# Altium project OBC_FyCUS23.PrjPcb
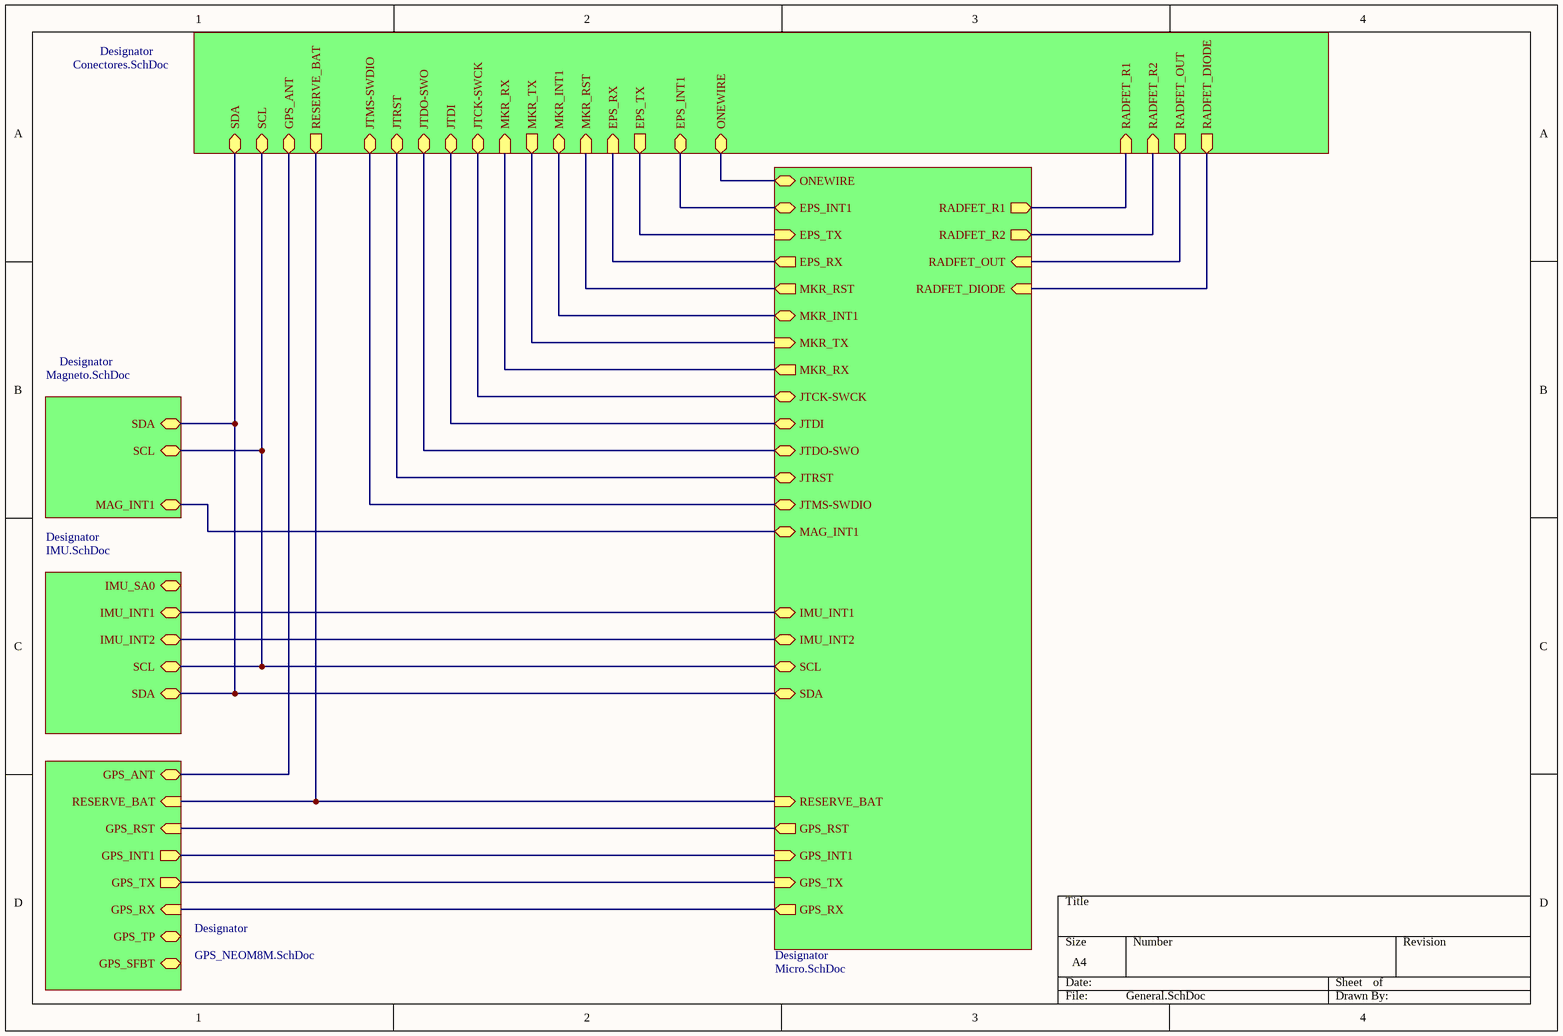
[diagram p0: General.SchDoc]
6 sheets, 50 parts. Net scope: hierarchical (ports join the sheet entries above them; power ports are global).
Board file: OBC_PCB.PcbDoc
Sheets:
  General.SchDoc
    Designator = GPS_NEOM8M.SchDoc
    Designator = Magneto.SchDoc
    Designator = Micro.SchDoc
    Designator = IMU.SchDoc
    Designator = Conectores.SchDoc

## Sheet General.SchDoc
size A4; SheetNumber: 1; SheetTotal: 6

### Sub-sheets
Designator = GPS_NEOM8M.SchDoc: GPS_RST (in), GPS_INT1 (out), GPS_TX (out), GPS_RX (in), RESERVE_BAT (in), GPS_TP (bidir), GPS_SFBT (bidir), GPS_ANT (bidir)
Designator = Magneto.SchDoc: SCL (bidir), SDA (bidir), MAG_INT1 (bidir)
Designator = Micro.SchDoc: GPS_RX (out), GPS_TX (in), GPS_INT1 (in), GPS_RST (out), IMU_INT1 (bidir), SCL (bidir), SDA (bidir), IMU_INT2 (bidir), MAG_INT1 (bidir), MKR_RX (out), MKR_TX (in), JTCK-SWCK (bidir), JTDI (bidir), JTDO-SWO (bidir), JTRST (bidir), JTMS-SWDIO (bidir), MKR_INT1 (bidir), MKR_RST (out), RESERVE_BAT (in), EPS_TX (in), EPS_RX (out), ONEWIRE (bidir), EPS_INT1 (bidir), RADFET_R1 (out), RADFET_R2 (out), RADFET_OUT (in), RADFET_DIODE (in)
Designator = IMU.SchDoc: IMU_SA0 (bidir), IMU_INT1 (bidir), SCL (bidir), SDA (bidir), IMU_INT2 (bidir)
Designator = Conectores.SchDoc: MKR_RX (in), MKR_TX (out), JTCK-SWCK (bidir), JTDI (bidir), JTDO-SWO (bidir), JTRST (bidir), JTMS-SWDIO (bidir), SCL (bidir), SDA (bidir), MKR_INT1 (bidir), MKR_RST (in), RESERVE_BAT (out), GPS_ANT (bidir), EPS_TX (out), EPS_RX (in), ONEWIRE (bidir), EPS_INT1 (bidir), RADFET_R1 (in), RADFET_R2 (in), RADFET_OUT (out), RADFET_DIODE (out)

### Nets
ANTENNA: sheet Designator/GPS_ANT, sheet Designator/GPS_ANT
JTCK-SWCK: sheet Designator/JTCK-SWCK, sheet Designator/JTCK-SWCK
JTDI: sheet Designator/JTDI, sheet Designator/JTDI
JTDO-SWO: sheet Designator/JTDO-SWO, sheet Designator/JTDO-SWO
JTMS-SWDIO: sheet Designator/JTMS-SWDIO, sheet Designator/JTMS-SWDIO
JTRST: sheet Designator/JTRST, sheet Designator/JTRST
LPUART1_RX: sheet Designator/MKR_TX, sheet Designator/MKR_TX
LPUART1_TX: sheet Designator/MKR_RX, sheet Designator/MKR_RX
ONEWIRE_PIN: sheet Designator/ONEWIRE, sheet Designator/ONEWIRE
SCL: sheet Designator/SCL, sheet Designator/SCL, sheet Designator/SCL, sheet Designator/SCL
SDA: sheet Designator/SDA, sheet Designator/SDA, sheet Designator/SDA, sheet Designator/SDA
USART2_RX: sheet Designator/EPS_TX, sheet Designator/EPS_TX
USART2_TX: sheet Designator/EPS_RX, sheet Designator/EPS_RX
USART3_RX: sheet Designator/GPS_TX, sheet Designator/GPS_TX
USART3_TX: sheet Designator/GPS_RX, sheet Designator/GPS_RX
VBAT: sheet Designator/RESERVE_BAT, sheet Designator/RESERVE_BAT, sheet Designator/RESERVE_BAT
NetC15_1: sheet Designator/MKR_RST, sheet Designator/MKR_RST
NetGPS_4: sheet Designator/GPS_INT1, sheet Designator/GPS_INT1
NetGPS_8: sheet Designator/GPS_RST, sheet Designator/GPS_RST
NetIMU_4: sheet Designator/IMU_INT1, sheet Designator/IMU_INT1
NetIMU_9: sheet Designator/IMU_INT2, sheet Designator/IMU_INT2
NetJ2_11: sheet Designator/RADFET_R1, sheet Designator/RADFET_R1
NetJ2_13: sheet Designator/RADFET_R2, sheet Designator/RADFET_R2
NetJ2_15: sheet Designator/RADFET_OUT, sheet Designator/RADFET_OUT
NetJ2_16: sheet Designator/RADFET_DIODE, sheet Designator/RADFET_DIODE
NetJ2_24: sheet Designator/EPS_INT1, sheet Designator/EPS_INT1
NetJ4_5: sheet Designator/MKR_INT1, sheet Designator/MKR_INT1
NetMAG_7: sheet Designator/MAG_INT1, sheet Designator/MAG_INT1

## Sheet GPS_NEOM8M.SchDoc
size A4; SheetNumber: 3; SheetTotal: 6
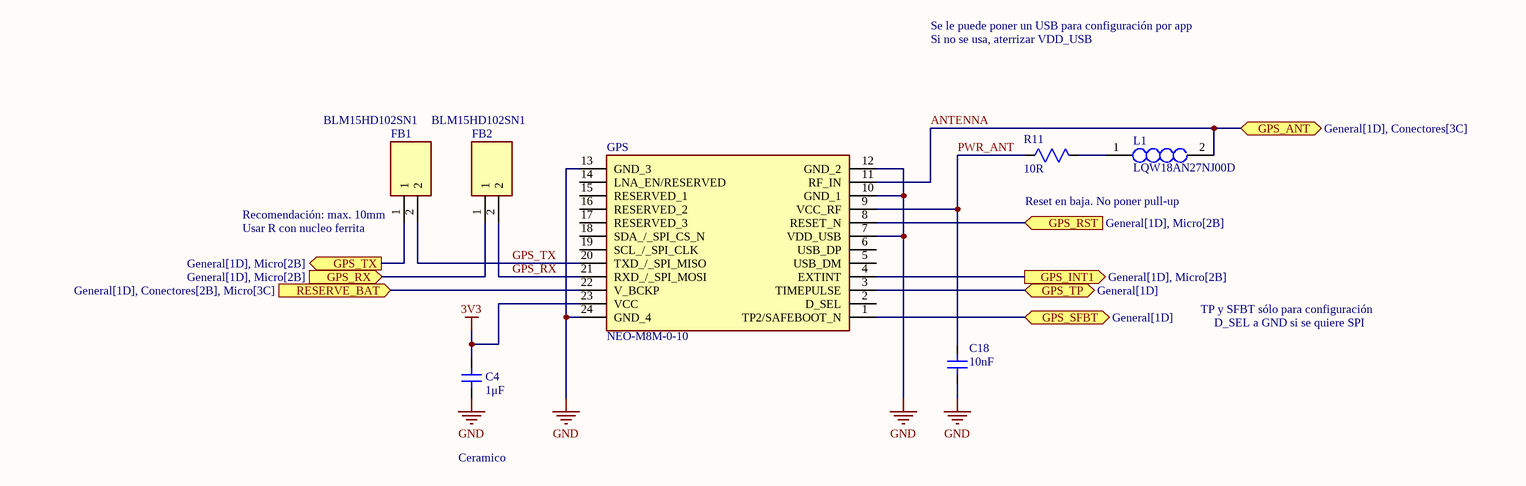
[diagram p1: GPS_NEOM8M.SchDoc]

### Parts
C4  Valor: 1μF  [CAP SMD 0805]  (hidden comment: CAP_0805_1uF)
C18  Valor: 10nF  [CAP SMD 0805]  (hidden comment: CAP_0805_1uF)
FB1  BLM15HD102SN1  [NFZ15SG152SN10B]
FB2  BLM15HD102SN1  [NFZ15SG152SN10B]
GPS  NEO-M8M-0-10  [NEO-M8T]
L1  LQW18AN27NJ00D  [LQW18AS10NG0CD]
R11  Valor: 10R  [RES SMD 0805]  (hidden comment: RES_0805_10k)

### Ports
GPS_ANT (bidir, see General[1D], Conectores[3C]), GPS_INT1 (out, see General[1D], Micro[2B]), GPS_RST (in, see General[1D], Micro[2B]), GPS_RX (in, see General[1D], Micro[2B]), GPS_SFBT (bidir, see General[1D]), GPS_TP (bidir, see General[1D]), GPS_TX (out, see General[1D], Micro[2B]), RESERVE_BAT (in, see General[1D], Conectores[2B], Micro[3C])

### Nets
3V3: C4.1 GPS.23(VCC)  [project net VDD]
GND: C4.2 C18.1 GPS.7(VDD_USB) GPS.10(GND_1) GPS.12(GND_2) GPS.13(GND_3) GPS.24(GND_4)
ANTENNA: GPS.11(RF_IN) L1.2 ; port GPS_ANT
GPS_RX: FB2.2 GPS.21(RXD_/_SPI_MOSI)
GPS_TX: FB1.2 GPS.20(TXD_/_SPI_MISO)
PWR_ANT: C18.2 GPS.9(VCC_RF) R11.1
USART3_RX: FB1.1 ; port GPS_TX
USART3_TX: FB2.1 ; port GPS_RX
VBAT: GPS.22(V_BCKP) ; port RESERVE_BAT
NetGPS_1: GPS.1(TP2/SAFEBOOT_N) ; port GPS_SFBT
NetGPS_3: GPS.3(TIMEPULSE) ; port GPS_TP
NetGPS_4: GPS.4(EXTINT) ; port GPS_INT1
NetGPS_8: GPS.8(RESET_N) ; port GPS_RST
NetL1_1: L1.1 R11.2

Not connected (* = marked no-connect by the designer): GPS 2(D_SEL) 5(USB_DM) 6(USB_DP) 14(LNA_EN/RESERVED) 15(RESERVED_1) 16(RESERVED_2) 17(RESERVED_3) 18(SDA_/_SPI_CS_N) 19(SCL_/_SPI_CLK)

### Notes on the sheet
- Se le puede poner un USB para configuración por app
- Si no se usa, aterrizar VDD_USB
- (near FB1) Recomendación: max. 10mm
- (near FB1) Usar R con nucleo ferrita
- Reset en baja. No poner pull-up
- TP y SFBT sólo para configuración
- D_SEL a GND si se quiere SPI
- Ceramico

### Library data of the parts
C4 C18 = CMP-081-000001-1: Condensador 0805 1uF; Distribuidor: -; RefFabricante: -; ComponentLink2URL: -; RefDistribuidor: -; ComponentLink2Description: Datasheet; ComponentLink1Description: Link-Compra; Design Item ID: CAP_0805_1uF; Source: ARUS2021.SchLib; Fabricante: -; ComponentLink1URL: -
FB1 FB2 = BLM15HD102SN1: Ferrite Bead; Manufacturer_Name: Murata Electronics; Datasheet Link: http://www.murata.com/~/media/webrenewal/support/library/catalog/products/emc/emifil/c31e.ashx?la=en-gb; Height: 0.55mm; Manufacturer_Part_Number: BLM15HD102SN1; Mouser Part Number: N/A; Mouser Price/Stock: https://www.mouser.co.uk/ProductDetail/Murata-Electronics/BLM15HD102SN1?qs=%2F7R%2FnUXKGoiRMnYJExxoAg%3D%3D
GPS = NEO-M8M-0-10: Integrated Circuit; Manufacturer_Name: U-Blox; Datasheet Link: https://www.u-blox.com/sites/default/files/NEO-M8-FW3_DataSheet_%28UBX-15031086%29.pdf; Manufacturer_Part_Number: NEO-M8M-0-10
L1 = LQW18AN27NJ00D: Inductor; Manufacturer_Name: Murata Electronics; Datasheet Link: https://psearch.en.murata.com/inductor/product/LQW18AN27NJ00%23.html; Height: 1mm; Manufacturer_Part_Number: LQW18AN27NJ00D; Mouser Part Number: 81-LQW18AN27NJ00D; Mouser Price/Stock: https://www.mouser.com/Search/Refine.aspx?Keyword=81-LQW18AN27NJ00D; Arrow Part Number: LQW18AN27NJ00D; Arrow Price/Stock: https://www.arrow.com/en/products/lqw18an27nj00d/murata-manufacturing
R11 = CMP-088-000003-1: Resistencia 0805 10k; Distribuidor: -; Fabricante: -; Design Item ID: RES_0805_10k; ComponentLink1Description: Link-Compra; RefDistribuidor: -; ComponentLink2Description: Datasheet; Source: ARUS2021.SchLib; ComponentLink1URL: -; RefFabricante: -; ComponentLink2URL: -

## Sheet Magneto.SchDoc
size A4; SheetNumber: 4; SheetTotal: 6
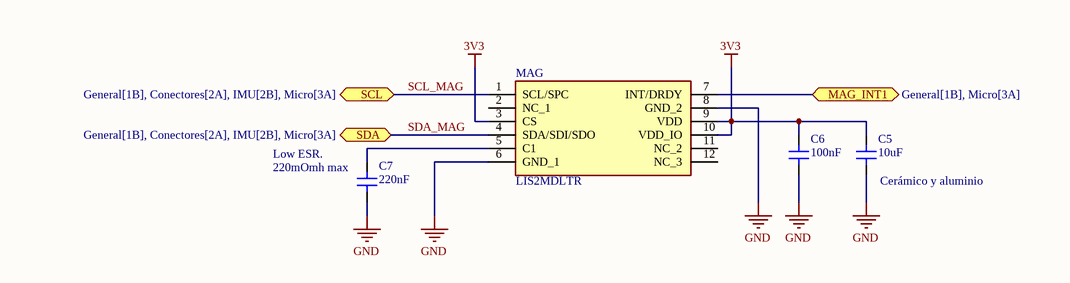
[diagram p2: Magneto.SchDoc]

### Parts
C5  Valor: 10uF  [CAP SMD 0805]  (hidden comment: CAP_0805_100nF)
C6  Valor: 100nF  [CAP SMD 0805]  (hidden comment: CAP_0805_100nF)
C7  Valor: 220nF  [CAP SMD 0805]  (hidden comment: CAP_0805_100nF)
MAG  LIS2MDLTR  [LGA-12]

### Ports
MAG_INT1 (bidir, see General[1B], Micro[3A]), SCL (bidir, see General[1B], Conectores[2A], IMU[2B], Micro[3A]), SDA (bidir, see General[1B], Conectores[2A], IMU[2B], Micro[3A])

### Nets
3V3: C5.2 C6.2 MAG.3(CS) MAG.9(VDD) MAG.10(VDD_IO)  [project net VDD]
GND: C5.1 C6.1 C7.2 MAG.6(GND_1) MAG.8(GND_2)
SCL_MAG: MAG.1(SCL/SPC) ; port SCL  [project net SCL]
SDA_MAG: MAG.4(SDA/SDI/SDO) ; port SDA  [project net SDA]
NetC7_1: C7.1 MAG.5(C1)
NetMAG_7: MAG.7(INT/DRDY) ; port MAG_INT1

Not connected (* = marked no-connect by the designer): MAG 2(NC_1) 11(NC_2) 12(NC_3)

### Notes on the sheet
- (near C7) Low ESR.
- (near C7) 220mOmh max
- (near C5) Cerámico y aluminio

### Library data of the parts
C5-C7 = CMP-067-0005-1: Condensador 0805 100nF; ComponentLink1URL: -; RefFabricante: -; ComponentLink2URL: -; Fabricante: -; ComponentLink2Description: Datasheet; Design Item ID: CAP_0805_100nF; ComponentLink1Description: Link-Compra; RefDistribuidor: -; Distribuidor: -; Source: BMS_Slave.SCHLIB
MAG = LIS2MDLTR: Integrated Circuit; Manufacturer_Name: STMicroelectronics; Datasheet Link: http://www.st.com/content/ccc/resource/technical/document/datasheet/group3/29/13/d1/e0/9a/4d/4f/30/DM00395193/files/DM00395193.pdf/jcr:content/translations/en.DM00395193.pdf; Manufacturer_Part_Number: LIS2MDLTR; Mouser Part Number: 511-LIS2MDLTR; Mouser Price/Stock: https://www.mouser.co.uk/ProductDetail/STMicroelectronics/LIS2MDLTR?qs=5aG0NVq1C4wS0n6b5NiBNQ%3D%3D; Arrow Part Number: LIS2MDLTR; Arrow Price/Stock: https://www.arrow.com/en/products/lis2mdltr/stmicroelectronics?region=nac

## Sheet Micro.SchDoc
size A4; SheetNumber: 5; SheetTotal: 6
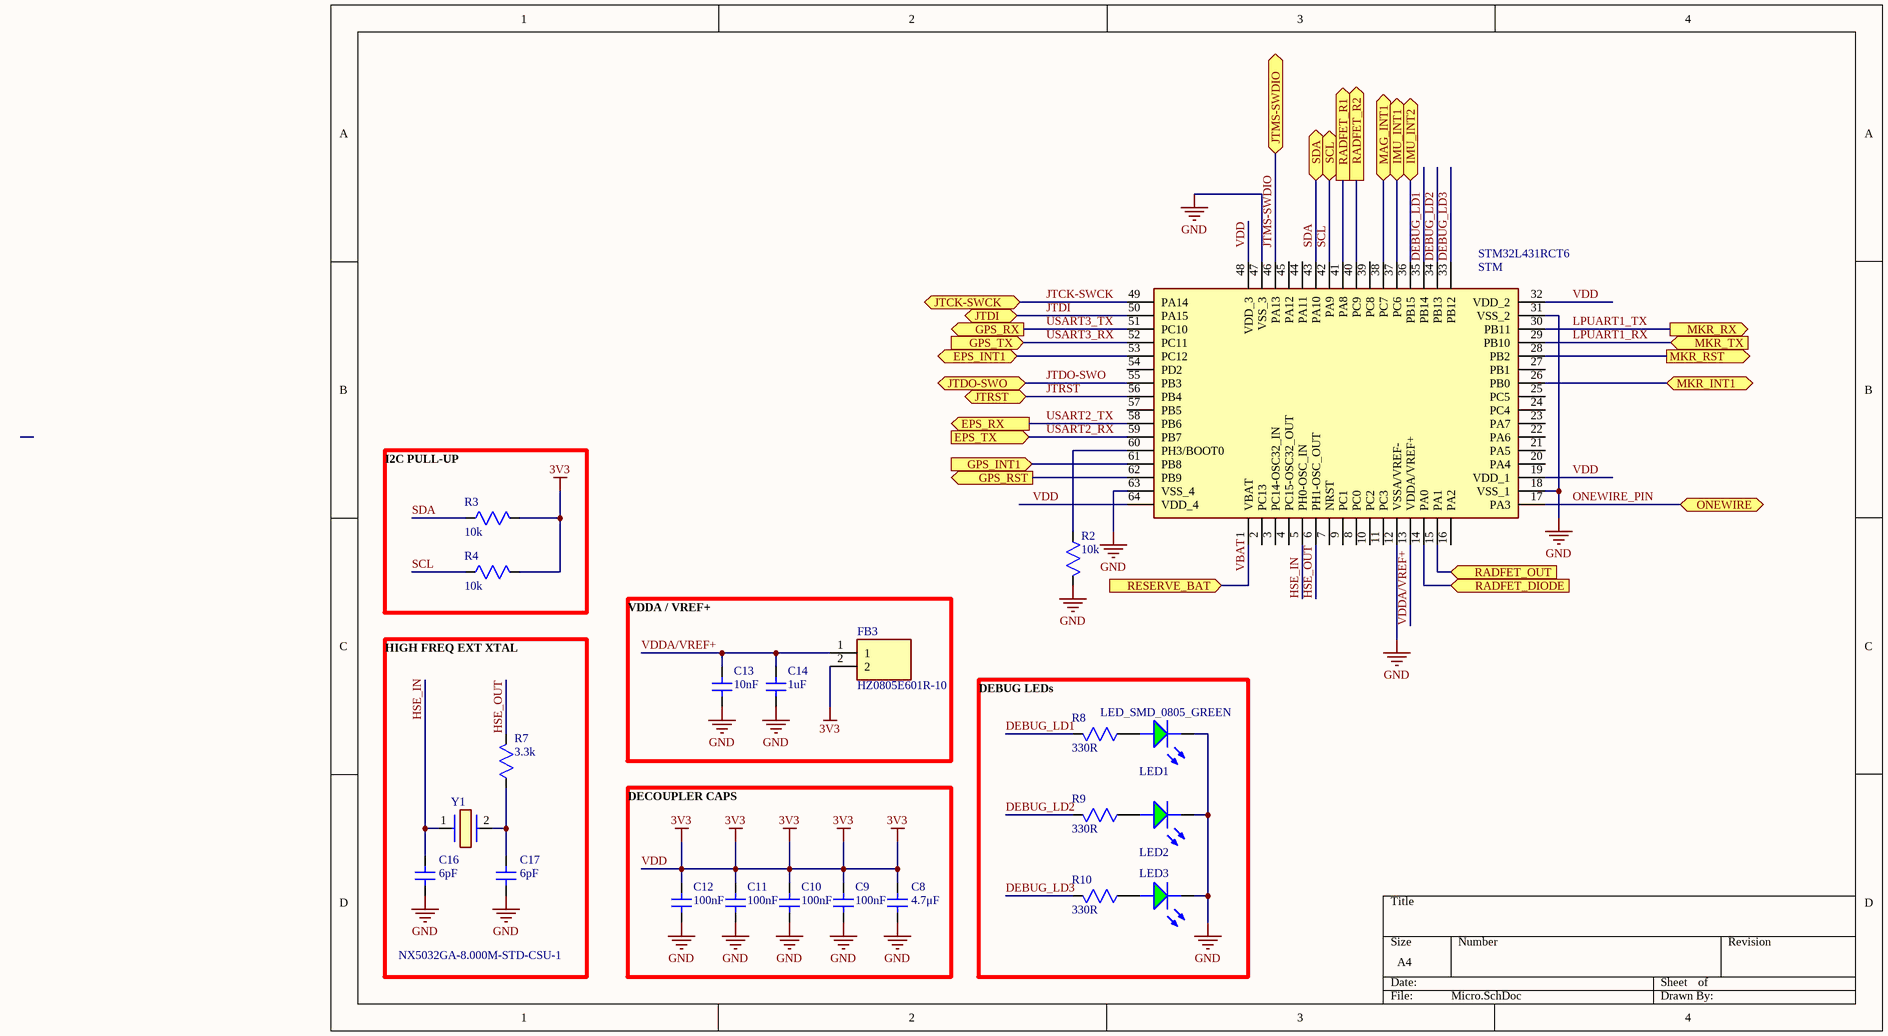
[diagram p3: Micro.SchDoc]

### Parts
C8  Valor: 4.7μF  [CAP SMD 0805]  (hidden comment: CAP_0805_4.7uF)
C9  Valor: 100nF  [CAP SMD 0805]  (hidden comment: CAP_0805_100nF)
C10  Valor: 100nF  [CAP SMD 0805]  (hidden comment: CAP_0805_100nF)
C11  Valor: 100nF  [CAP SMD 0805]  (hidden comment: CAP_0805_100nF)
C12  Valor: 100nF  [CAP SMD 0805]  (hidden comment: CAP_0805_100nF)
C13  Valor: 10nF  [CAP SMD 0805]  (hidden comment: CAP_0805_100nF)
C14  Valor: 1uF  [CAP SMD 0805]  (hidden comment: CAP_0805_100nF)
C16  Valor: 6pF  [CAP SMD 0805]  (hidden comment: CAP_0805_4.7uF)
C17  Valor: 6pF  [CAP SMD 0805]  (hidden comment: CAP_0805_4.7uF)
FB3  HZ0805E601R-10  [BEADC2012X110N]
LED1  LED_SMD_0805_GREEN  [LED SMD 0805 GREEN]  (value not drawn)
LED2  LED_SMD_0805_GREEN  [LED SMD 0805 GREEN]  (value not drawn)
LED3  LED_SMD_0805_GREEN  [LED SMD 0805 GREEN]
R2  Valor: 10k  [RES SMD 0805]  (hidden comment: RES_0805_10k)
R3  Valor: 10k  [RES SMD 0805]  (hidden comment: RES_0805_10k)
R4  Valor: 10k  [RES SMD 0805]  (hidden comment: RES_0805_10k)
R7  Valor: 3.3k  [RES SMD 0805]  (hidden comment: RES_0805_10k)
R8  Valor: 330R  [RES SMD 0805]  (hidden comment: RES_0805_10k)
R9  Valor: 330R  [RES SMD 0805]  (hidden comment: RES_0805_10k)
R10  Valor: 330R  [RES SMD 0805]  (hidden comment: RES_0805_10k)
STM  STM32L431RCT6  [QFP50P1200X1200X160-64N]
Y1  NX5032GA-8.000M-STD-CSU-1  [NX5032GA8000MSTDCSU1]

### Ports
EPS_INT1 (bidir, see General[2A], Conectores[3A]), EPS_RX (out, see General[2B], Conectores[2B]), EPS_TX (in, see General[2A], Conectores[2B]), GPS_INT1 (in, see General[2D], GPS_NEOM8M[3B]), GPS_RST (out, see General[2D], GPS_NEOM8M[3B]), GPS_RX (out, see General[2D], GPS_NEOM8M[1B]), GPS_TX (in, see General[2D], GPS_NEOM8M[1B]), IMU_INT1 (bidir, see General[2C], IMU[2B]), IMU_INT2 (bidir, see General[2C], IMU[3B]), JTCK-SWCK (bidir, see General[2B], Conectores[1B]), JTDI (bidir, see General[2B], Conectores[1B]), JTDO-SWO (bidir, see General[2B], Conectores[1B]), JTMS-SWDIO (bidir, see General[2B], Conectores[1B]), JTRST (bidir, see General[2B], Conectores[1C]), MAG_INT1 (bidir, see General[2C], Magneto[3B]), MKR_INT1 (bidir, see General[2B], Conectores[3D]), MKR_RST (out, see General[2B], Conectores[2D]), MKR_RX (out, see General[2B], Conectores[2D]), MKR_TX (in, see General[2B], Conectores[2D]), ONEWIRE (bidir, see General[2A], Conectores[1C]), RADFET_DIODE (in, see General[3B], Conectores[3A]), RADFET_OUT (in, see General[3B], Conectores[2A]), RADFET_R1 (out, see General[3A], Conectores[2A]), RADFET_R2 (out, see General[3A], Conectores[2A]), RESERVE_BAT (in, see General[2D], Conectores[2B], GPS_NEOM8M[1B]), SCL (bidir, see General[2C], Conectores[2A], Conectores[4B], IMU[2B], Magneto[2B]), SDA (bidir, see General[2C], Conectores[2A], Conectores[4B], IMU[2B], Magneto[2B])

### Nets
GND: C8.2 C9.2 C10.2 C11.2 C12.2 C13.2 C14.2 C16.2 C17.2 LED1.2(K) LED2.2(K) LED3.2(K) R2.2 STM.12(VSSA/VREF-) STM.18(VSS_1) STM.31(VSS_2) STM.47(VSS_3) STM.63(VSS_4)
VDD: C8.1 C9.1 C10.1 C11.1 C12.1 FB3.2 R3.2 R4.2 STM.19(VDD_1) STM.32(VDD_2) STM.48(VDD_3) STM.64(VDD_4)  [also labelled 3V3]
DEBUG_LD1: R8.2 STM.35(PB14)
DEBUG_LD2: R9.2 STM.34(PB13)
DEBUG_LD3: R10.2 STM.33(PB12)
HSE_IN: C16.1 STM.5(PH0-OSC_IN) Y1.1
HSE_OUT: R7.2 STM.6(PH1-OSC_OUT)
JTCK-SWCK: STM.49(PA14) ; port JTCK-SWCK
JTDI: STM.50(PA15) ; port JTDI
JTDO-SWO: STM.55(PB3) ; port JTDO-SWO
JTMS-SWDIO: STM.46(PA13) ; port JTMS-SWDIO
JTRST: STM.56(PB4) ; port JTRST
LPUART1_RX: STM.29(PB10) ; port MKR_TX
LPUART1_TX: STM.30(PB11) ; port MKR_RX
ONEWIRE_PIN: STM.17(PA3) ; port ONEWIRE
SCL: R4.1 STM.42(PA9) ; port SCL
SDA: R3.1 STM.43(PA10) ; port SDA
USART2_RX: STM.59(PB7) ; port EPS_TX
USART2_TX: STM.58(PB6) ; port EPS_RX
USART3_RX: STM.52(PC11) ; port GPS_TX
USART3_TX: STM.51(PC10) ; port GPS_RX
VBAT: STM.1(VBAT) ; port RESERVE_BAT
VDDA/VREF+: C13.1 C14.1 FB3.1 STM.13(VDDA/VREF+)
NetC15_1: STM.28(PB2) ; port MKR_RST
NetC17_1: C17.1 R7.1 Y1.2
NetGPS_4: STM.61(PB8) ; port GPS_INT1
NetGPS_8: STM.62(PB9) ; port GPS_RST
NetIMU_4: STM.37(PC6) ; port IMU_INT1
NetIMU_9: STM.36(PB15) ; port IMU_INT2
NetJ2_11: STM.41(PA8) ; port RADFET_R1
NetJ2_13: STM.40(PC9) ; port RADFET_R2
NetJ2_15: STM.15(PA1) ; port RADFET_OUT
NetJ2_16: STM.14(PA0) ; port RADFET_DIODE
NetJ2_24: STM.53(PC12) ; port EPS_INT1
NetJ4_5: STM.26(PB0) ; port MKR_INT1
NetLED1_1: LED1.1(A) R8.1
NetLED2_1: LED2.1(A) R9.1
NetLED3_1: LED3.1(A) R10.1
NetMAG_7: STM.38(PC7) ; port MAG_INT1
NetR2_1: R2.1 STM.60(PH3/BOOT0)

Not connected (* = marked no-connect by the designer): STM 2(PC13) 3(PC14-OSC32_IN) 4(PC15-OSC32_OUT) 7(NRST) 8(PC0) 9(PC1) 10(PC2) 11(PC3) 16(PA2) 20(PA4) 21(PA5) 22(PA6) 23(PA7) 24(PC4) 25(PC5) 27(PB1) 39(PC8) 44(PA11) 45(PA12) 54(PD2) 57(PB5)

### Notes on the sheet
- I2C PULL-UP
- VDDA / VREF+
- HIGH FREQ EXT XTAL
- DECOUPLER CAPS
- DEBUG LEDs

### Library data of the parts
C8 C16 C17 = CMP-067-0006-1: Condensador 0805 4.7uF; ComponentLink2Description: Datasheet; ComponentLink1Description: Link-Compra; ComponentLink1URL: -; Distribuidor: -; RefDistribuidor: -; Fabricante: -; Design Item ID: CAP_0805_4.7uF; Source: BMS_Slave.SCHLIB; RefFabricante: -; ComponentLink2URL: -
C9-C14 = CMP-081-000008-1: Condensador 0805 100nF; Fabricante: -; Design Item ID: CAP_0805_100nF; ComponentLink1URL: -; Distribuidor: -; Source: ARUS2021.SchLib; RefDistribuidor: -; RefFabricante: -; ComponentLink2URL: -; ComponentLink1Description: Link-Compra; ComponentLink2Description: Datasheet
FB3 = HZ0805E601R-10: Ferrite Bead; Manufacturer_Name: Laird Performance Materials; Datasheet Link: https://www.laird.com/sites/default/files/hz0805e601r-10-datasheet.pdf; Height: 1.1mm; Manufacturer_Part_Number: HZ0805E601R-10; Mouser Part Number: 875-HZ0805E601R-10; Mouser Price/Stock: https://www.mouser.co.uk/ProductDetail/Laird-Performance-Materials/HZ0805E601R-10?qs=DAHzmYU9cu2bOVmQ1ZEMSg%3D%3D
LED1-LED3 = CMP-072-0002-1: LED SMD 0805 GREEN; Fabricante: OSRAM Opto Semiconductors; RefFabricante: LG R971; ComponentLink1Description: Link-Compra; RefDistribuidor: 654-5773; Distribuidor: RS; ComponentLink1URL: https://es.rs-online.com/web/p/leds/6545773/; Source: BMS_Slave.SCHLIB; Design Item ID: LED_SMD_0805_GREEN; ComponentLink2Description: Datasheet; ComponentLink2URL: https://docs.rs-online.com/0832/0900766b808ce012.pdf
R2-R4 R7-R10 = CMP-088-000003-1: Resistencia 0805 10k; Distribuidor: -; Fabricante: -; Design Item ID: RES_0805_10k; ComponentLink1Description: Link-Compra; RefDistribuidor: -; ComponentLink2Description: Datasheet; Source: ARUS2021.SchLib; ComponentLink1URL: -; RefFabricante: -; ComponentLink2URL: -
STM = STM32L431RCT6: Integrated Circuit; Manufacturer_Name: STMicroelectronics; Datasheet Link: https://www.st.com/resource/en/datasheet/stm32l431rc.pdf; Height: 1.6mm; Manufacturer_Part_Number: STM32L431RCT6; Mouser Part Number: 511-STM32L431RCT6; Mouser Price/Stock: https://www.mouser.co.uk/ProductDetail/STMicroelectronics/STM32L431RCT6?qs=U58vgkJzipQt4Fiogdks1w%3D%3D; Arrow Part Number: STM32L431RCT6; Arrow Price/Stock: https://www.arrow.com/en/products/stm32l431rct6/stmicroelectronics?region=nac
Y1 = NX5032GA-8.000M-STD-CSU-1: Crystal or Oscillator; Manufacturer_Name: NIHON DEMPA KOGYO; Datasheet Link: https://static6.arrow.com/aropdfconversion/be518cb37ea4b57b328fa8b9d5e6b91cdc288b57/c_nx5032ga-2_e.pdf; Height: 1.5mm; Manufacturer_Part_Number: NX5032GA-8.000M-STD-CSU-1

## Sheet IMU.SchDoc
size A4; SheetNumber: 2; SheetTotal: 6
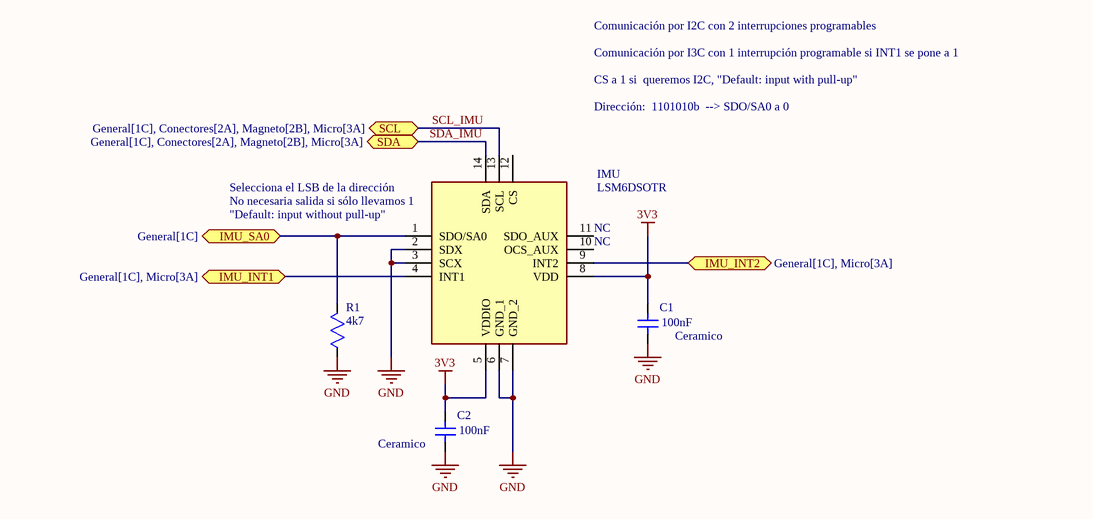
[diagram p4: IMU.SchDoc]

### Parts
C1  Valor: 100nF  [CAP SMD 0805]  (hidden comment: CAP_0805_100nF)
C2  Valor: 100nF  [CAP SMD 0805]  (hidden comment: CAP_0805_100nF)
IMU  LSM6DSOTR  [LGA-14(2.5X3X0.86)]
R1  Valor: 4k7  [RES SMD 0805]  (hidden comment: RES_0805_4k7)

### Ports
IMU_INT1 (bidir, see General[1C], Micro[3A]), IMU_INT2 (bidir, see General[1C], Micro[3A]), IMU_SA0 (bidir, see General[1C]), SCL (bidir, see General[1C], Conectores[2A], Magneto[2B], Micro[3A]), SDA (bidir, see General[1C], Conectores[2A], Magneto[2B], Micro[3A])

### Nets
3V3: C1.1 C2.1 IMU.5(VDDIO) IMU.8(VDD)  [project net VDD]
GND: C1.2 C2.2 IMU.2(SDX) IMU.3(SCX) IMU.6(GND_1) IMU.7(GND_2) R1.1
SCL_IMU: IMU.13(SCL) ; port SCL  [project net SCL]
SDA_IMU: IMU.14(SDA) ; port SDA  [project net SDA]
NetIMU_1: IMU.1(SDO/SA0) R1.2 ; port IMU_SA0
NetIMU_4: IMU.4(INT1) ; port IMU_INT1
NetIMU_9: IMU.9(INT2) ; port IMU_INT2

Not connected (* = marked no-connect by the designer): IMU 10(OCS_AUX) 11(SDO_AUX) 12(CS)

### Notes on the sheet
- Comunicación por I2C con 2 interrupciones programables
- Comunicación por I3C con 1 interrupción programable si INT1 se pone a 1
- CS a 1 si  queremos I2C, "Default: input with pull-up"
- Dirección:  1101010b  --> SDO/SA0 a 0
- (near IMU) No necesaria salida si sólo llevamos 1
- (near IMU) Selecciona el LSB de la dirección
- (near IMU) "Default: input without pull-up"
- (near IMU) NC
- (near C1) Ceramico
- (near C2) Ceramico

### Library data of the parts
C1 C2 = CMP-081-000008-1: Condensador 0805 100nF; Fabricante: -; Design Item ID: CAP_0805_100nF; ComponentLink1URL: -; Distribuidor: -; Source: ARUS2021.SchLib; RefDistribuidor: -; RefFabricante: -; ComponentLink2URL: -; ComponentLink1Description: Link-Compra; ComponentLink2Description: Datasheet
IMU = LSM6DSOTR: Accelerometer; Manufacturer_Name: STMicroelectronics; Datasheet Link: https://www.st.com/resource/en/datasheet/lsm6dso.pdf; Manufacturer_Part_Number: LSM6DSOTR; Mouser Part Number: 511-LSM6DSOTR; Mouser Price/Stock: https://www.mouser.co.uk/ProductDetail/STMicroelectronics/LSM6DSOTR?qs=lc2O%252BfHJPVbD197C5c7oNw%3D%3D; Arrow Part Number: LSM6DSOTR; Arrow Price/Stock: https://www.arrow.com/en/products/lsm6dsotr/stmicroelectronics?region=nac
R1 = CMP-088-000005-1: Resistencia 0805 4k7; RefDistribuidor: -; ComponentLink1Description: Link-Compra; Design Item ID: RES_0805_4k7; Fabricante: -; ComponentLink1URL: -; Source: ARUS2021.SchLib; ComponentLink2URL: -; RefFabricante: -; ComponentLink2Description: Datasheet; Distribuidor: -

## Sheet Conectores.SchDoc
size A4; SheetNumber: 6; SheetTotal: 6
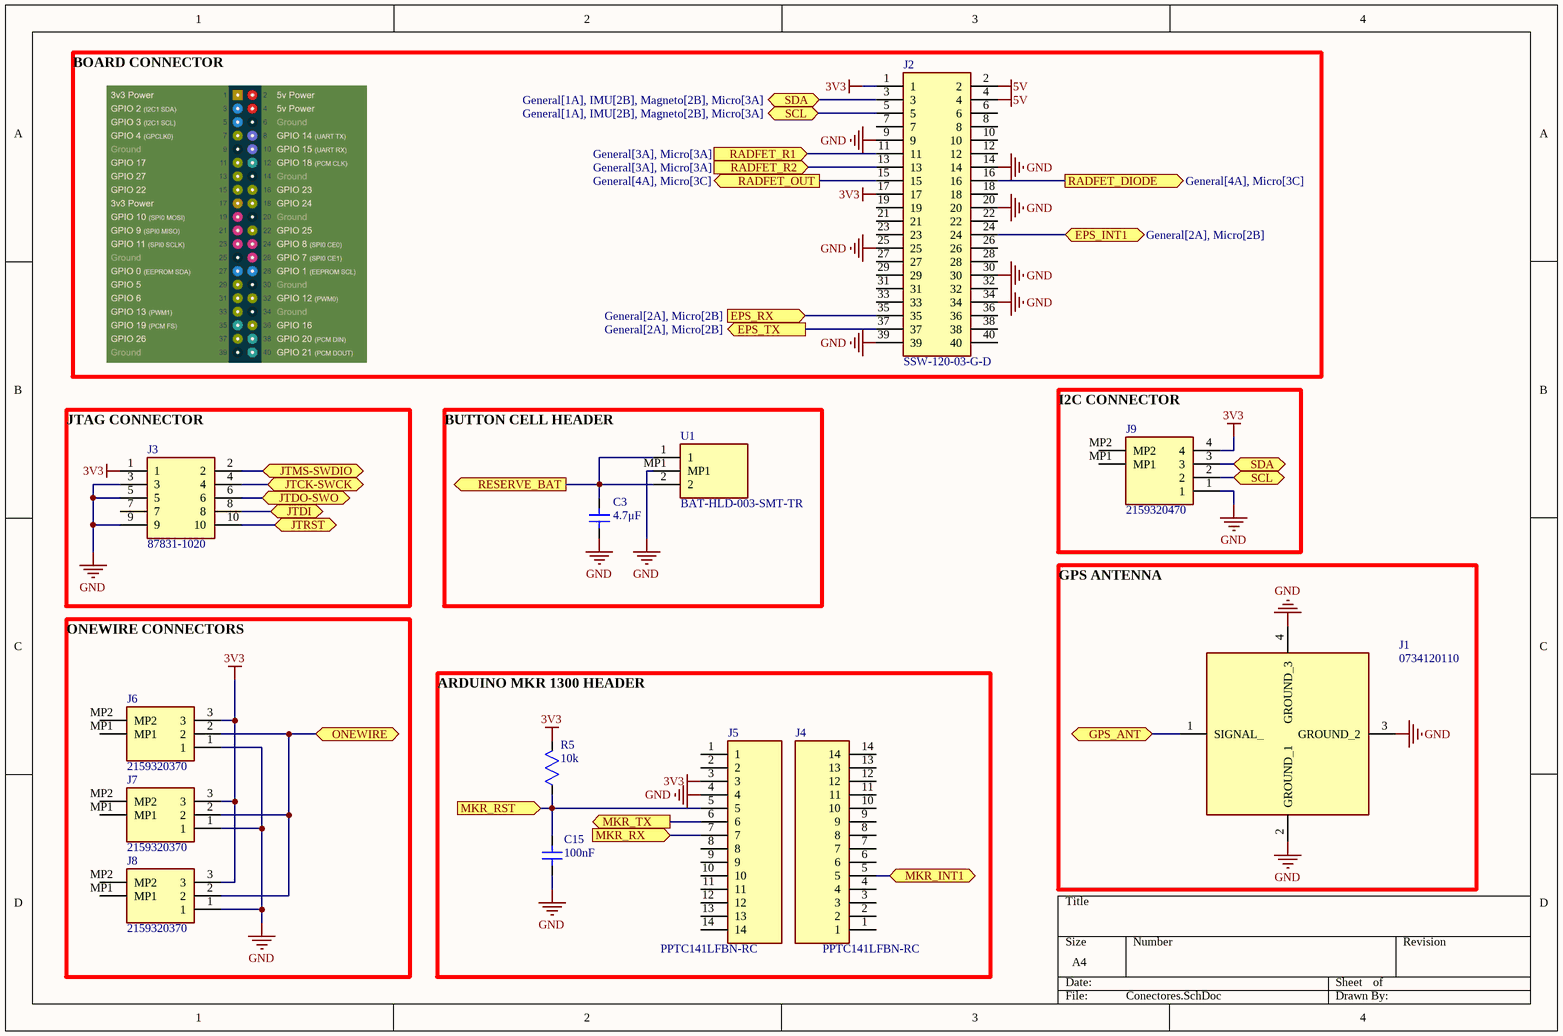
[diagram p5: Conectores.SchDoc]

### Parts
C3  Valor: 4.7μF  [CAP SMD 0805]  (hidden comment: CAP_0805_1uF)
C15  Valor: 100nF  [CAP SMD 0805]  (hidden comment: CAP_0805_100nF)
J1  0734120110  [0734120110]
J2  SSW-120-03-G-D  [RHDR40W79P254_2X20_5131X495X851P]
J3  87831-1020  [SHDR10W55P200_2X5_1265X630X640P]
J4  PPTC141LFBN-RC  [RHDR14W80P0X254_1X14_3606X254X850P]
J5  PPTC141LFBN-RC  [RHDR14W80P0X254_1X14_3606X254X850P]
J6  2159320370  [2159320370]
J7  2159320370  [2159320370]
J8  2159320370  [2159320370]
J9  2159320470  [2159320470]
R5  Valor: 10k  [RES SMD 0805]  (hidden comment: RES_0805_10k)
U1  BAT-HLD-003-SMT-TR  [BATHLD003SMTTR]

### Ports
EPS_INT1 (bidir, see General[2A], Micro[2B]), EPS_RX (in, see General[2A], Micro[2B]), EPS_TX (out, see General[2A], Micro[2B]), GPS_ANT (bidir, see General[1A], GPS_NEOM8M[4B]), JTCK-SWCK (bidir, see General[2A], Micro[2B]), JTDI (bidir, see General[2A], Micro[2B]), JTDO-SWO (bidir, see General[2A], Micro[2B]), JTMS-SWDIO (bidir, see General[1A], Micro[3A]), JTRST (bidir, see General[2A], Micro[2B]), MKR_INT1 (bidir, see General[2A], Micro[4B]), MKR_RST (in, see General[2A], Micro[4B]), MKR_RX (in, see General[2A], Micro[4B]), MKR_TX (out, see General[2A], Micro[4B]), ONEWIRE (bidir, see General[2A], Micro[4B]), RADFET_DIODE (out, see General[4A], Micro[3C]), RADFET_OUT (out, see General[4A], Micro[3C]), RADFET_R1 (in, see General[3A], Micro[3A]), RADFET_R2 (in, see General[3A], Micro[3A]), RESERVE_BAT (out, see General[1A], GPS_NEOM8M[1B], Micro[3C]), SCL (bidir, see General[1A], IMU[2B], Magneto[2B], Micro[3A]), SDA (bidir, see General[1A], IMU[2B], Magneto[2B], Micro[3A])

### Nets
3V3: J2.1 J2.17 J3.1 J5.3 J6.3 J7.3 J8.3 J9.4 R5.2  [project net VDD]
5V: J2.2 J2.4
GND: C3.2 C15.2 J1.2(GROUND_1) J1.3(GROUND_2) J1.4(GROUND_3) J2.9 J2.14 J2.20 J2.25 J2.30 J2.34 J2.39 J3.3 J3.5 J3.9 J5.4 J6.1 J7.1 J8.1 J9.1 U1.MP1
ANTENNA: J1.1(SIGNAL_) ; port GPS_ANT
JTCK-SWCK: J3.4 ; port JTCK-SWCK
JTDI: J3.8 ; port JTDI
JTDO-SWO: J3.6 ; port JTDO-SWO
JTMS-SWDIO: J3.2 ; port JTMS-SWDIO
JTRST: J3.10 ; port JTRST
LPUART1_RX: J5.6 ; port MKR_TX
LPUART1_TX: J5.7 ; port MKR_RX
ONEWIRE_PIN: J6.2 J7.2 J8.2 ; port ONEWIRE
SCL: J2.5 J9.2 ; port SCL
SDA: J2.3 J9.3 ; port SDA
USART2_RX: J2.37 ; port EPS_TX
USART2_TX: J2.35 ; port EPS_RX
VBAT: C3.1 U1.1 U1.2 ; port RESERVE_BAT
NetC15_1: C15.1 J5.5 R5.1 ; port MKR_RST
NetJ2_11: J2.11 ; port RADFET_R1
NetJ2_13: J2.13 ; port RADFET_R2
NetJ2_15: J2.15 ; port RADFET_OUT
NetJ2_16: J2.16 ; port RADFET_DIODE
NetJ2_24: J2.24 ; port EPS_INT1
NetJ4_5: J4.5 ; port MKR_INT1

Not connected (* = marked no-connect by the designer): J2 6 7 8 10 12 18 19 21 22 23 26 27 28 29 31 32 33 36 38 40; J3 7; J4 1 2 3 4 6 7 8 9 10 11 12 13 14; J5 1 2 8 9 10 11 12 13 14; J6 MP1 MP2; J7 MP1 MP2; J8 MP1 MP2; J9 MP1 MP2

### Notes on the sheet
- (near J2) BOARD CONNECTOR
- (near J9) I2C CONNECTOR
- (near J3) JTAG CONNECTOR
- BUTTON CELL HEADER
- (near J1) GPS ANTENNA
- ONEWIRE CONNECTORS
- ARDUINO MKR 1300 HEADER

### Library data of the parts
C3 = CMP-081-000001-1: Condensador 0805 1uF; Distribuidor: -; RefFabricante: -; ComponentLink2URL: -; RefDistribuidor: -; ComponentLink2Description: Datasheet; ComponentLink1Description: Link-Compra; Design Item ID: CAP_0805_1uF; Source: ARUS2021.SchLib; Fabricante: -; ComponentLink1URL: -
C15 = CMP-081-000008-1: Condensador 0805 100nF; Fabricante: -; Design Item ID: CAP_0805_100nF; ComponentLink1URL: -; Distribuidor: -; Source: ARUS2021.SchLib; RefDistribuidor: -; RefFabricante: -; ComponentLink2URL: -; ComponentLink1Description: Link-Compra; ComponentLink2Description: Datasheet
J1 = 0734120110: Connector; Manufacturer_Name: Molex; Datasheet Link: https://www.molex.com/pdm_docs/sd/734120110_sd.pdf; Height: 1.36mm; Manufacturer_Part_Number: 0734120110; Mouser Part Number: N/A; Mouser Price/Stock: https://www.mouser.co.uk/ProductDetail/Molex/0734120110?qs=PBcRNPEHKsq%2FACQpFpzyEA%3D%3D; Arrow Part Number: 0734120110; Arrow Price/Stock: https://www.arrow.com/en/products/0734120110/molex?region=europe
J2 = SSW-120-03-G-D: Connector; Manufacturer_Name: SAMTEC; Datasheet Link: http://suddendocs.samtec.com/prints/ssw-1xx-xx-xxx-x-xx-xxx-xx-mkt.pdf; Height: 8.51mm; Manufacturer_Part_Number: SSW-120-03-G-D; Mouser Part Number: 200-SSW12003GD; Mouser Price/Stock: https://www.mouser.co.uk/ProductDetail/Samtec/SSW-120-03-G-D?qs=rU5fayqh%252BE2ll3JgDoNINQ%3D%3D; Arrow Part Number: SSW-120-03-G-D; Arrow Price/Stock: https://www.arrow.com/en/products/ssw-120-03-g-d/samtec?region=nac
J3 = CMP-138-000000-1: Header 2.00mm Milli-Grid, vert, TH, 10w Molex MILLI-GRID Series, Series Number 87831, 2mm Pitch 10 Way 2 Row Straight PCB Header, Solder Termination, 2A; Geometry.Height: 6.4mm; Arrow Price/Stock: *; Datasheet Link: https://datasheet.datasheetarchive.com/originals/distributors/SFDatasheet-1/sf-00036740.pdf; Manufacturer_Name: Molex; Design Item ID: 87831-1020; Arrow Part Number: *; Mouser Price/Stock: https://www.mouser.co.uk/ProductDetail/Molex/87831-1020?qs=8PELaTI4Pt8k%2F%2FV9vKeYIg%3D%3D; Source: 87831-1020.SchLib; Mouser Part Number: 538-87831-1020; Manufacturer_Part_Number: 87831-1020
J4 J5 = PPTC141LFBN-RC: Connector; Manufacturer_Name: Sullins; Datasheet Link: http://www.sullinscorp.com/drawings/78_P(N)PxCxxxLFBN-RC,_10492-H.pdf; Height: 8.5mm; Manufacturer_Part_Number: PPTC141LFBN-RC
J6-J8 = 2159320370: Connector; Manufacturer_Name: Molex; Datasheet Link: https://www.molex.com/pdm_docs/sd/2159320370_sd.pdf; Height: 7.5mm; Manufacturer_Part_Number: 2159320370
J9 = 2159320470: Connector; Manufacturer_Name: Molex; Datasheet Link: https://www.molex.com/webdocs/datasheets/pdf/en-us/2159320470_PCB_HEADERS.pdf; Height: 7.5mm; Manufacturer_Part_Number: 2159320470
R5 = CMP-088-000003-1: Resistencia 0805 10k; Distribuidor: -; Fabricante: -; Design Item ID: RES_0805_10k; ComponentLink1Description: Link-Compra; RefDistribuidor: -; ComponentLink2Description: Datasheet; Source: ARUS2021.SchLib; ComponentLink1URL: -; RefFabricante: -; ComponentLink2URL: -
U1 = BAT-HLD-003-SMT-TR: Undefined or Miscellaneous; Manufacturer_Name: Linx Technologies; Datasheet Link: https://linxtechnologies.com/wp/wp-content/uploads/bat-hld-003-smt-ds.pdf; Height: 4.2mm; Manufacturer_Part_Number: BAT-HLD-003-SMT-TR; Mouser Part Number: 712-BAT-HLD-003SMTTR; Mouser Price/Stock: https://www.mouser.co.uk/ProductDetail/Linx-Technologies/BAT-HLD-003-SMT-TR?qs=TuK3vfAjtkVhl445ZsgJ1g%3D%3D

## Nets that join several sheets
GND: GPS_NEOM8M (7 pins), Magneto (5 pins), Micro (18 pins), IMU (7 pins), Conectores (21 pins)
VDD: GPS_NEOM8M (C4.1 GPS.23), Magneto (5 pins), Micro (12 pins), IMU (C1.1 C2.1 IMU.5 IMU.8), Conectores (9 pins)
ANTENNA: GPS_NEOM8M (GPS.11 L1.2), Conectores (J1.1)
JTCK-SWCK: Micro (STM.49), Conectores (J3.4)
JTDI: Micro (STM.50), Conectores (J3.8)
JTDO-SWO: Micro (STM.55), Conectores (J3.6)
JTMS-SWDIO: Micro (STM.46), Conectores (J3.2)
JTRST: Micro (STM.56), Conectores (J3.10)
LPUART1_RX: Micro (STM.29), Conectores (J5.6)
LPUART1_TX: Micro (STM.30), Conectores (J5.7)
NetC15_1: Micro (STM.28), Conectores (C15.1 J5.5 R5.1)
NetGPS_4: GPS_NEOM8M (GPS.4), Micro (STM.61)
NetGPS_8: GPS_NEOM8M (GPS.8), Micro (STM.62)
NetIMU_4: Micro (STM.37), IMU (IMU.4)
NetIMU_9: Micro (STM.36), IMU (IMU.9)
NetJ2_11: Micro (STM.41), Conectores (J2.11)
NetJ2_13: Micro (STM.40), Conectores (J2.13)
NetJ2_15: Micro (STM.15), Conectores (J2.15)
NetJ2_16: Micro (STM.14), Conectores (J2.16)
NetJ2_24: Micro (STM.53), Conectores (J2.24)
NetJ4_5: Micro (STM.26), Conectores (J4.5)
NetMAG_7: Magneto (MAG.7), Micro (STM.38)
ONEWIRE_PIN: Micro (STM.17), Conectores (J6.2 J7.2 J8.2)
SCL: Magneto (MAG.1), Micro (R4.1 STM.42), IMU (IMU.13), Conectores (J2.5 J9.2)
SDA: Magneto (MAG.4), Micro (R3.1 STM.43), IMU (IMU.14), Conectores (J2.3 J9.3)
USART2_RX: Micro (STM.59), Conectores (J2.37)
USART2_TX: Micro (STM.58), Conectores (J2.35)
USART3_RX: GPS_NEOM8M (FB1.1), Micro (STM.52)
USART3_TX: GPS_NEOM8M (FB2.1), Micro (STM.51)
VBAT: GPS_NEOM8M (GPS.22), Micro (STM.1), Conectores (C3.1 U1.1 U1.2)